# EAGLE design gumbi (EAGLE 5.11)
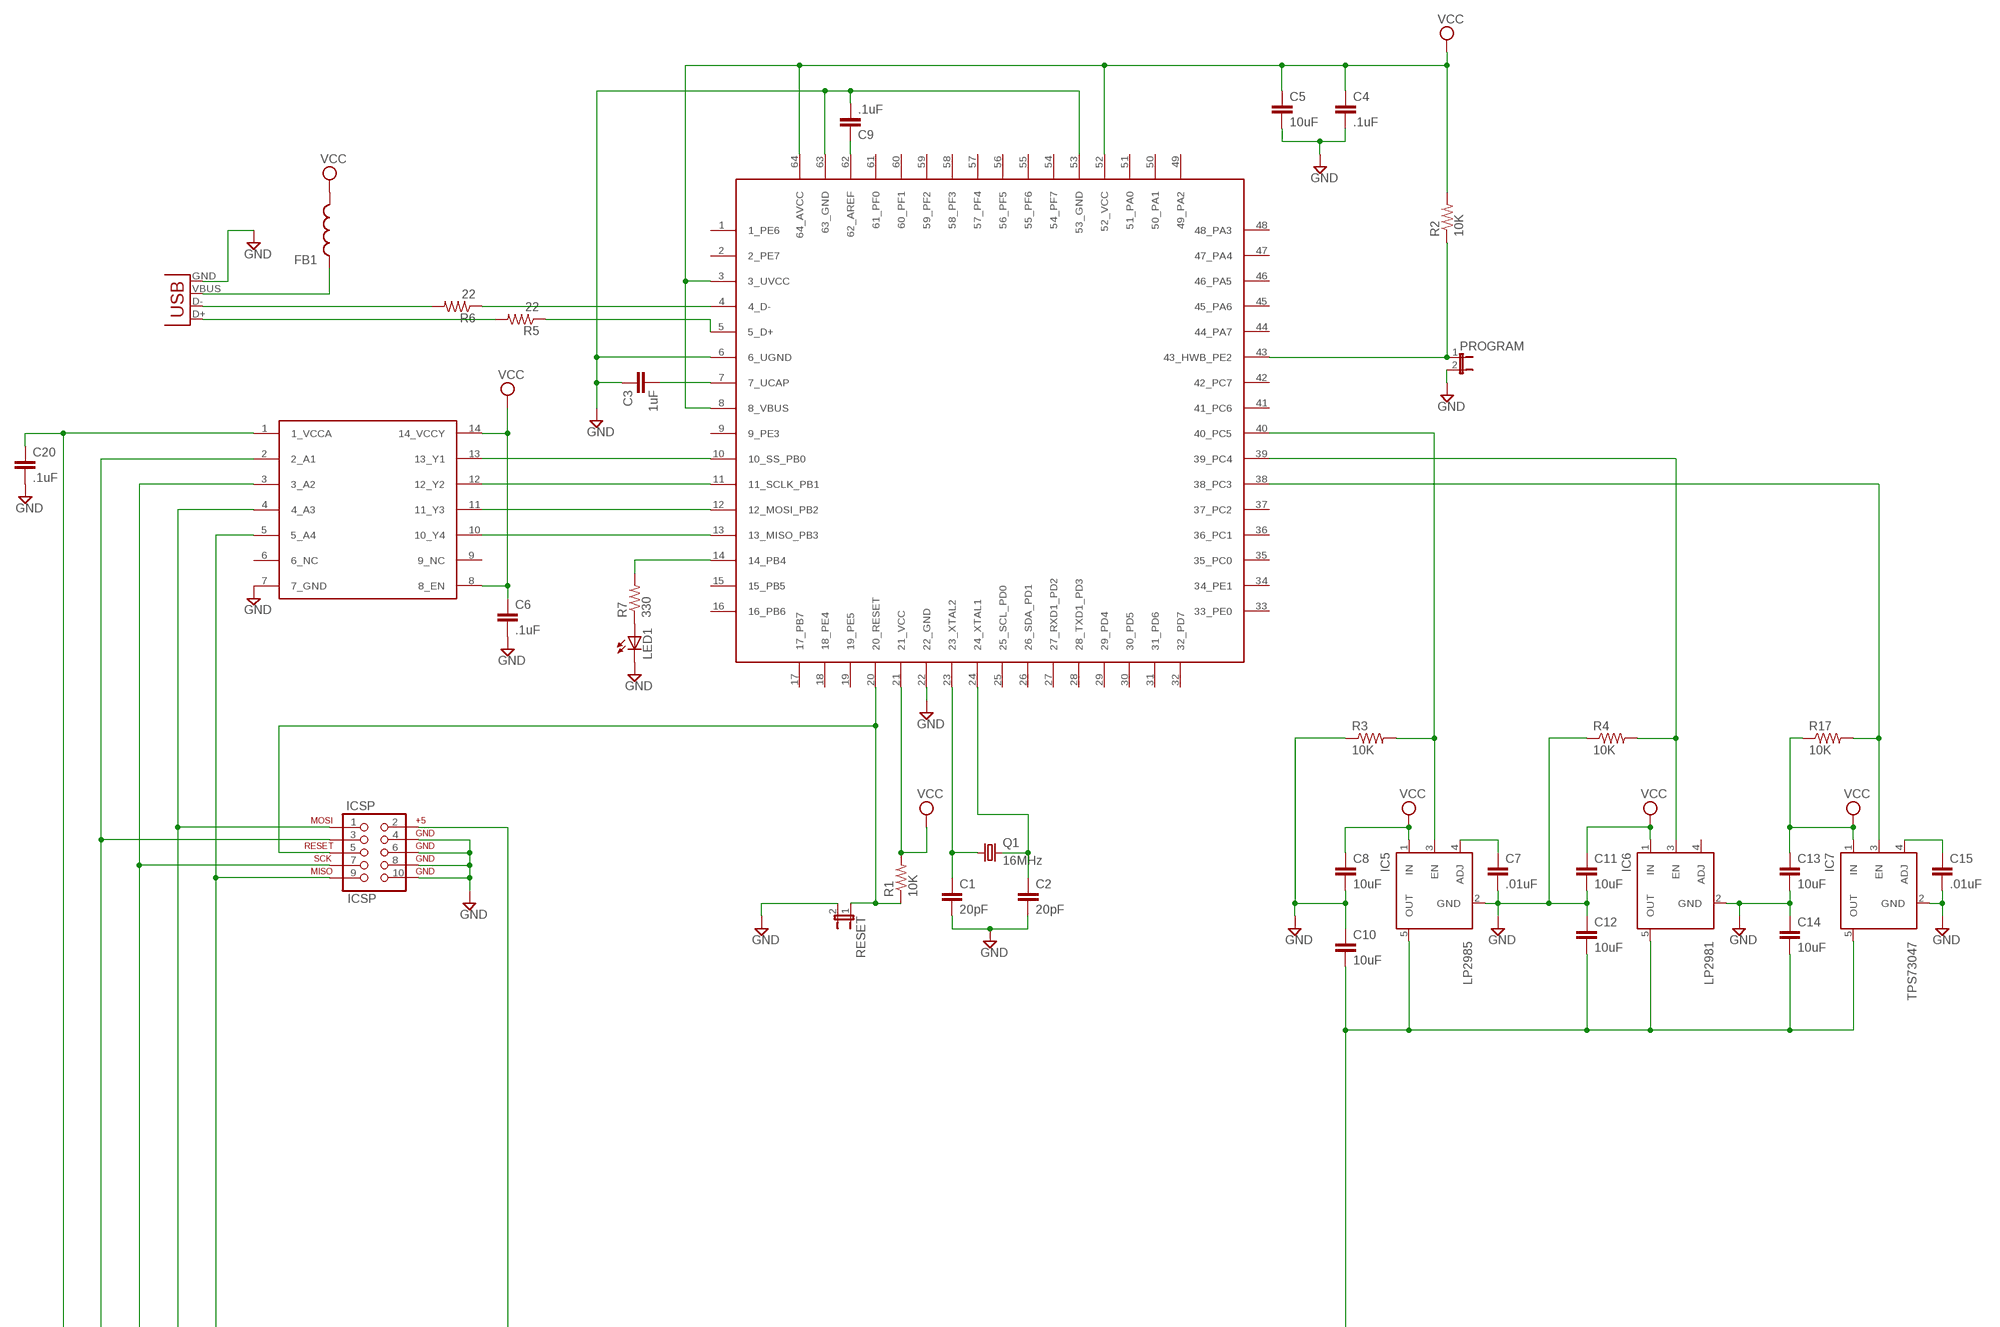
[diagram p0: schematic, sheet 1, part 1 of 2]
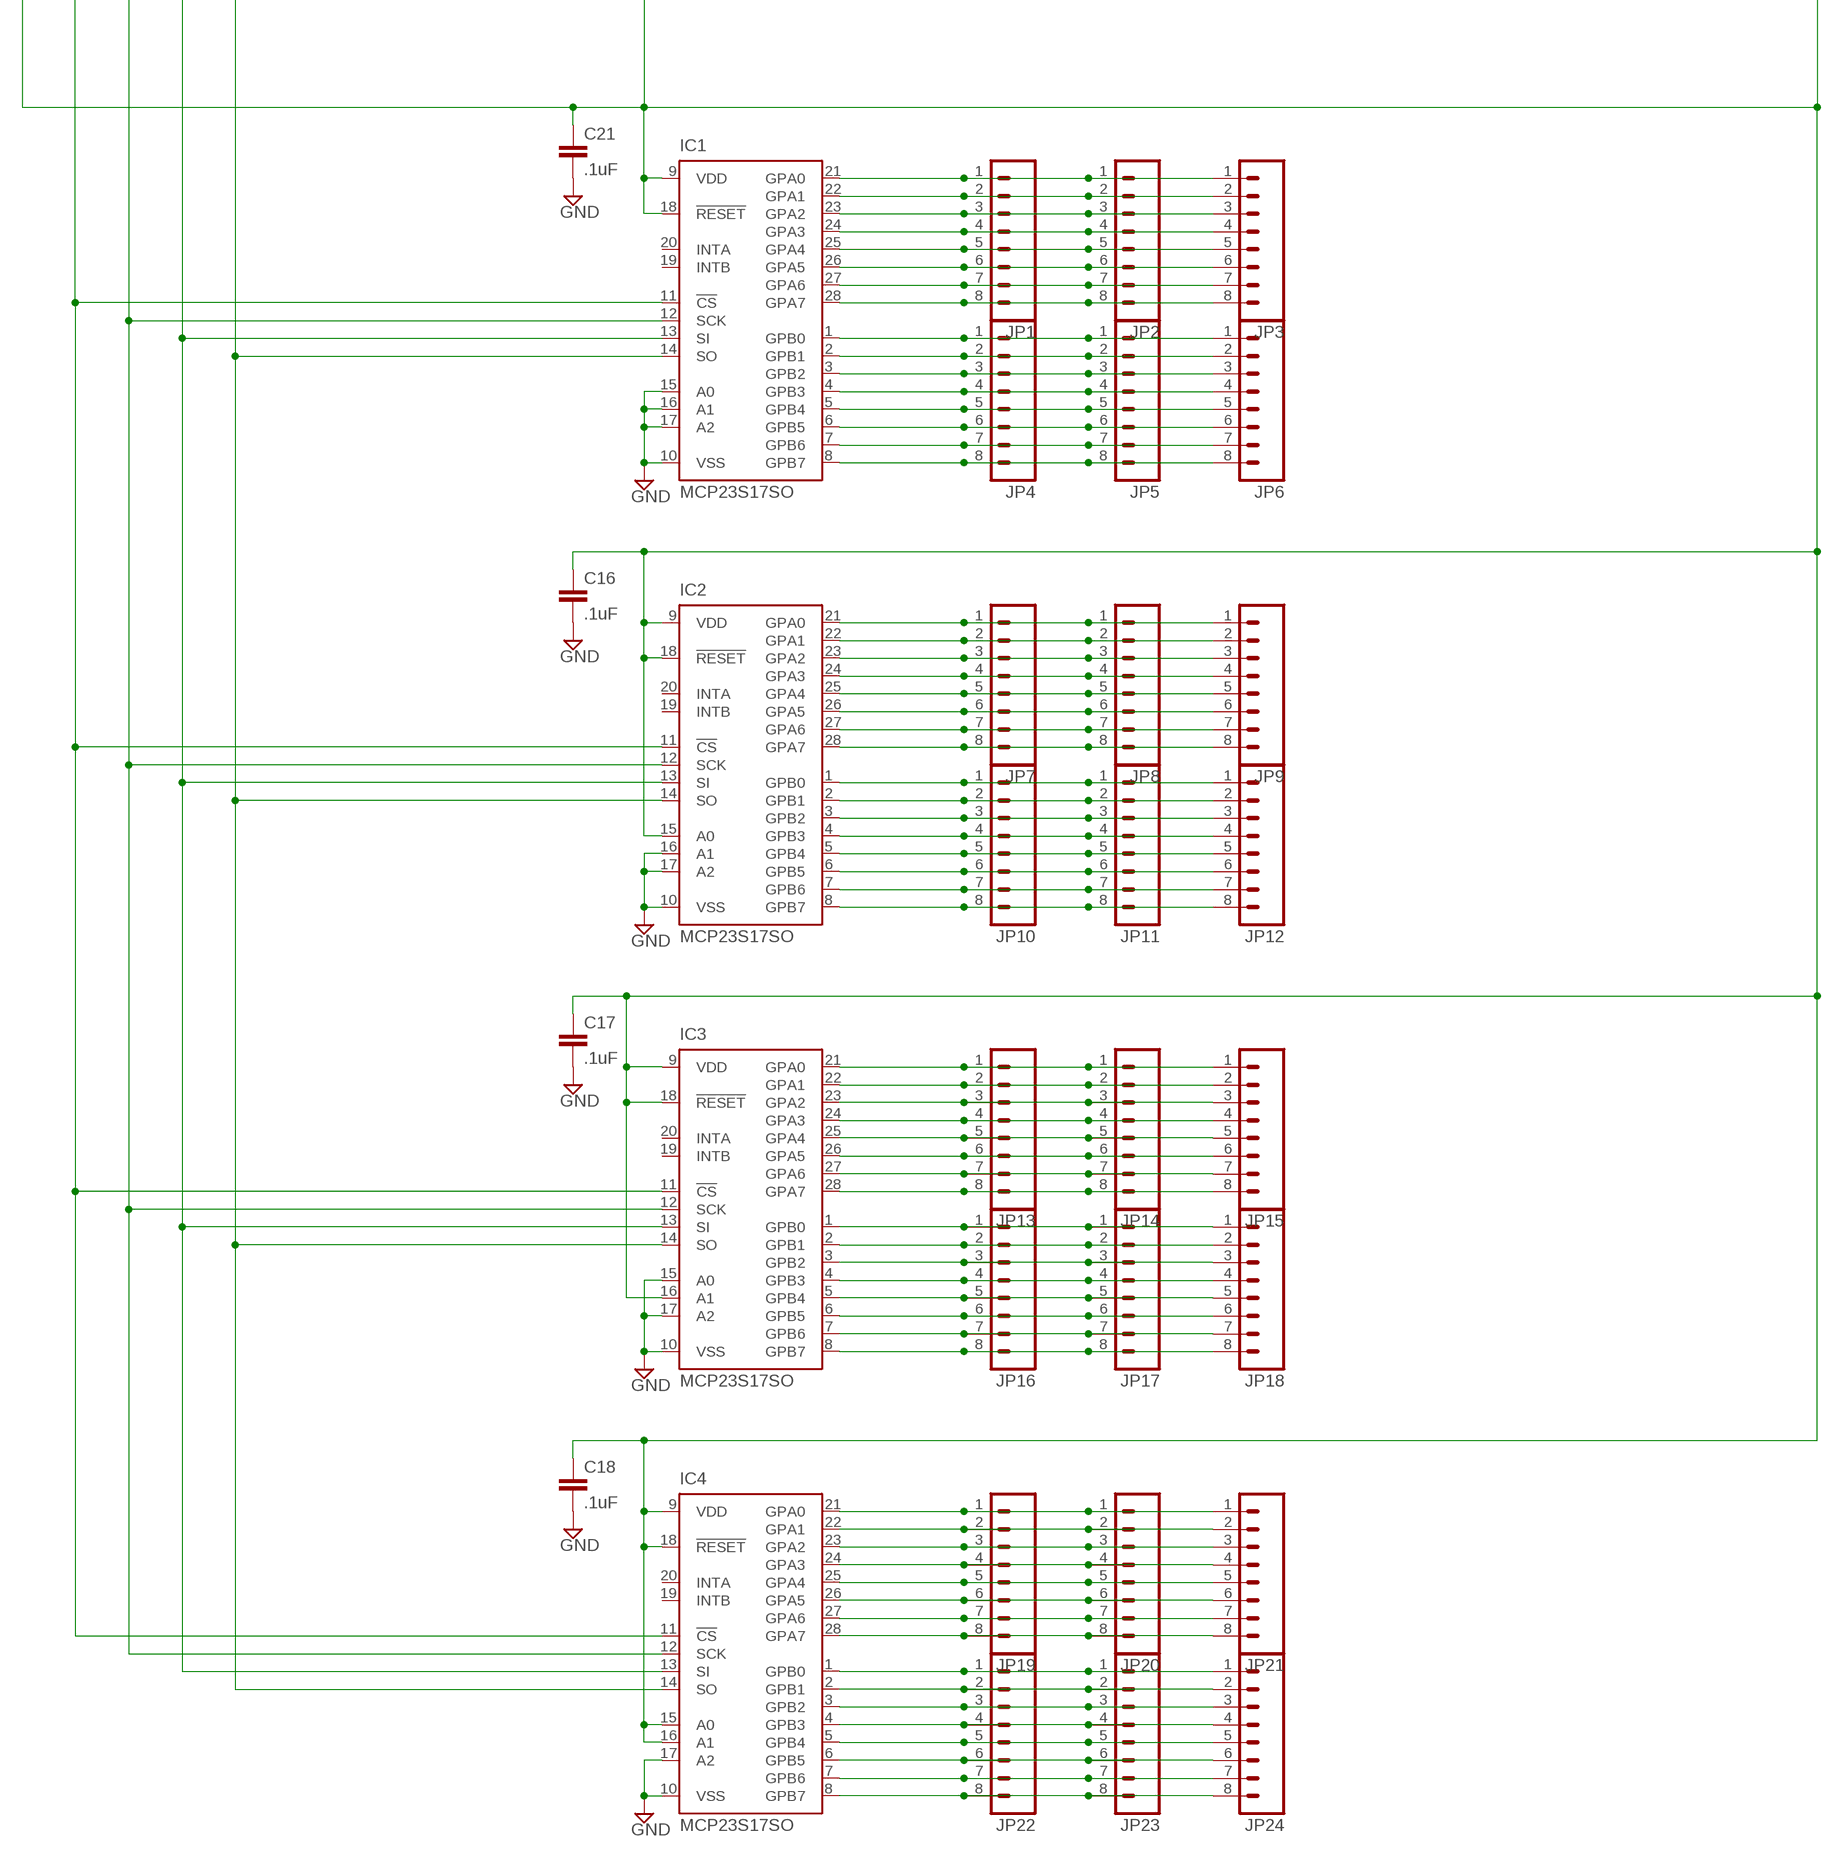
[diagram p1: schematic, sheet 1, part 2 of 2]

## Parts
C1  20pF  CAP0805  [0805]
C2  20pF  CAP0805  [0805]
C3  1uF  CAP0805  [0805]
C4  .1uF  CAP0805  [0805]
C5  10uF  CAP0805  [0805]
C6  .1uF  CAP0805  [0805]
C7  .01uF  CAP0805  [0805]
C8  10uF  CAP0805  [0805]
C9  .1uF  CAP0805  [0805]
C10  10uF  CAP0805  [0805]
C11  10uF  CAP0805  [0805]
C12  10uF  CAP0805  [0805]
C13  10uF  CAP0805  [0805]
C14  10uF  CAP0805  [0805]
C15  .01uF  CAP0805  [0805]
C16  .1uF  CAP0805  [0805]
C17  .1uF  CAP0805  [0805]
C18  .1uF  CAP0805  [0805]
C20  .1uF  CAP0805  [0805]
C21  .1uF  CAP0805  [0805]
FB1  INDUCTOR0805  [0805]
IC1  MCP23S17SO  [SO28W]
IC2  MCP23S17SO  [SO28W]
IC3  MCP23S17SO  [SO28W]
IC4  MCP23S17SO  [SO28W]
IC5  LP2985  MIC5219BM5  [SOT23-5]
IC6  LP2981  MIC5219BM5  [SOT23-5]
IC7  TPS73047  MIC5219BM5  [SOT23-5]
ICSP  ICSP  AVR_SPI_PROG  [AVR_ICSP]
JP1  M081X08  [1X08]
JP2  M081X08  [1X08]
JP3  M081X08  [1X08]
JP4  M081X08  [1X08]
JP5  M081X08  [1X08]
JP6  M081X08  [1X08]
JP7  M081X08  [1X08]
JP8  M081X08  [1X08]
JP9  M081X08  [1X08]
JP10  M081X08  [1X08]
JP11  M081X08  [1X08]
JP12  M081X08  [1X08]
JP13  M081X08  [1X08]
JP14  M081X08  [1X08]
JP15  M081X08  [1X08]
JP16  M081X08  [1X08]
JP17  M081X08  [1X08]
JP18  M081X08  [1X08]
JP19  M081X08  [1X08]
JP20  M081X08  [1X08]
JP21  M081X08  [1X08]
JP22  M081X08  [1X08]
JP23  M081X08  [1X08]
JP24  M081X08  [1X08]
LED1  LED0603  [LED-0603]
PROGRAM  JUMPER-2PTH  [1X02]
Q1  16MHz  CRYSTALSM49  [SM49]
R1  10K  RESISTOR0805-RES  [0805]
R2  10K  RESISTOR0805-RES  [0805]
R3  10K  RESISTOR0805-RES  [0805]
R4  10K  RESISTOR0805-RES  [0805]
R5  22  RESISTOR0805-RES  [0805]
R6  22  RESISTOR0805-RES  [0805]
R7  330  RESISTOR0805-RES  [0805]
R17  10K  RESISTOR0805-RES  [0805]
RESET  JUMPER-2PTH  [1X02]
U1  AT90USB1287  [TQFP64]
U2  ADG3304  [TSSOP14]
X1  USBSMD  [USB-MINIB]

## Nets
GND: C1.2 C2.2 C3.1 C4.2 C5.2 C6.2 C7.2 C8.2 C9.2 C10.1 C11.2 C12.1 C13.2 C14.1 C15.2 C16.2 C17.2 C18.2 C20.2 C21.2 IC1.10(VSS) IC1.15(A0) IC1.16(A1) IC1.17(A2) IC2.10(VSS) IC2.16(A1) IC2.17(A2) IC3.10(VSS) IC3.15(A0) IC3.17(A2) IC4.10(VSS) IC4.17(A2) IC5.2(GND) IC6.2(GND) IC7.2(GND) ICSP.4 ICSP.6 ICSP.8 ICSP.10 LED1.C PROGRAM.2 R3.1 R4.1 RESET.2 U1.6(6_UGND) U1.22(22_GND) U1.53(53_GND) U1.63(63_GND) U2.7(7_GND) X1.GND
N$1: U1.10(10_SS_PB0) U2.13(13_Y1)
N$2: U1.11(11_SCLK_PB1) U2.12(12_Y2)
N$3: U1.12(12_MOSI_PB2) U2.11(11_Y3)
N$4: C9.1 U1.62(62_AREF)
N$5: LED1.A R7.1
N$6: C2.1 Q1.2 U1.24(24_XTAL1)
N$7: R6.2 X1.D-
N$8: ICSP.5 R1.1 RESET.1 U1.20(20_RESET)
N$9: C10.2 C12.2 C14.2 C16.1 C17.1 C18.1 C20.1 C21.1 IC1.9(VDD) IC1.18(!RESET) IC2.9(VDD) IC2.15(A0) IC2.18(!RESET) IC3.9(VDD) IC3.16(A1) IC3.18(!RESET) IC4.9(VDD) IC4.15(A0) IC4.16(A1) IC4.18(!RESET) IC5.5(OUT) IC6.5(OUT) IC7.5(OUT) ICSP.2 U2.1(1_VCCA)
N$10: C3.2 U1.7(7_UCAP)
N$11: R5.1 U1.5(5_D+)
N$12: C1.1 Q1.1 U1.23(23_XTAL2)
N$13: IC1.21(GPA0) JP1.1 JP2.1 JP3.1
N$14: PROGRAM.1 R2.1 U1.43(43_HWB_PE2)
N$15: U1.13(13_MISO_PB3) U2.10(10_Y4)
N$16: R6.1 U1.4(4_D-)
N$17: R5.2 X1.D+
N$18: FB1.1 X1.VBUS
N$19: IC1.22(GPA1) JP1.2 JP2.2 JP3.2
N$20: IC1.23(GPA2) JP1.3 JP2.3 JP3.3
N$21: R7.2 U1.14(14_PB4)
N$22: IC1.24(GPA3) JP1.4 JP2.4 JP3.4
N$23: IC1.25(GPA4) JP1.5 JP2.5 JP3.5
N$24: IC1.26(GPA5) JP1.6 JP2.6 JP3.6
N$25: IC1.27(GPA6) JP1.7 JP2.7 JP3.7
N$26: IC1.28(GPA7) JP1.8 JP2.8 JP3.8
N$27: IC1.1(GPB0) JP4.1 JP5.1 JP6.1
N$28: IC1.2(GPB1) JP4.2 JP5.2 JP6.2
N$29: IC1.3(GPB2) JP4.3 JP5.3 JP6.3
N$30: IC1.4(GPB3) JP4.4 JP5.4 JP6.4
N$31: IC1.5(GPB4) JP4.5 JP5.5 JP6.5
N$32: IC1.6(GPB5) JP4.6 JP5.6 JP6.6
N$33: IC1.7(GPB6) JP4.7 JP5.7 JP6.7
N$34: IC1.8(GPB7) JP4.8 JP5.8 JP6.8
N$35: IC2.21(GPA0) JP7.1 JP8.1 JP9.1
N$36: IC2.22(GPA1) JP7.2 JP8.2 JP9.2
N$37: IC2.23(GPA2) JP7.3 JP8.3 JP9.3
N$38: IC2.24(GPA3) JP7.4 JP8.4 JP9.4
N$39: IC2.25(GPA4) JP7.5 JP8.5 JP9.5
N$40: IC2.26(GPA5) JP7.6 JP8.6 JP9.6
N$41: IC2.27(GPA6) JP7.7 JP8.7 JP9.7
N$42: IC2.28(GPA7) JP7.8 JP8.8 JP9.8
N$43: IC2.1(GPB0) JP10.1 JP11.1 JP12.1
N$44: IC2.2(GPB1) JP10.2 JP11.2 JP12.2
N$45: IC2.3(GPB2) JP10.3 JP11.3 JP12.3
N$46: IC2.4(GPB3) JP10.4 JP11.4 JP12.4
N$47: IC2.5(GPB4) JP10.5 JP11.5 JP12.5
N$48: IC2.6(GPB5) JP10.6 JP11.6 JP12.6
N$49: IC2.7(GPB6) JP10.7 JP11.7 JP12.7
N$50: IC2.8(GPB7) JP10.8 JP11.8 JP12.8
N$51: IC3.21(GPA0) JP13.1 JP14.1 JP15.1
N$52: IC3.22(GPA1) JP13.2 JP14.2 JP15.2
N$53: IC3.23(GPA2) JP13.3 JP14.3 JP15.3
N$54: IC3.24(GPA3) JP13.4 JP14.4 JP15.4
N$55: IC3.25(GPA4) JP13.5 JP14.5 JP15.5
N$56: IC3.26(GPA5) JP13.6 JP14.6 JP15.6
N$57: IC3.27(GPA6) JP13.7 JP14.7 JP15.7
N$58: IC3.28(GPA7) JP13.8 JP14.8 JP15.8
N$59: IC3.1(GPB0) JP16.1 JP17.1 JP18.1
N$60: IC3.2(GPB1) JP16.2 JP17.2 JP18.2
N$61: IC3.3(GPB2) JP16.3 JP17.3 JP18.3
N$62: IC3.4(GPB3) JP16.4 JP17.4 JP18.4
N$63: IC3.5(GPB4) JP16.5 JP17.5 JP18.5
N$64: IC3.6(GPB5) JP16.6 JP17.6 JP18.6
N$65: IC3.7(GPB6) JP16.7 JP17.7 JP18.7
N$66: IC3.8(GPB7) JP16.8 JP17.8 JP18.8
N$67: IC4.21(GPA0) JP19.1 JP20.1 JP21.1
N$68: IC4.22(GPA1) JP19.2 JP20.2 JP21.2
N$69: IC4.23(GPA2) JP19.3 JP20.3 JP21.3
N$70: IC4.24(GPA3) JP19.4 JP20.4 JP21.4
N$71: IC4.25(GPA4) JP19.5 JP20.5 JP21.5
N$72: IC4.26(GPA5) JP19.6 JP20.6 JP21.6
N$73: IC4.27(GPA6) JP19.7 JP20.7 JP21.7
N$74: IC4.28(GPA7) JP19.8 JP20.8 JP21.8
N$75: IC4.1(GPB0) JP22.1 JP23.1 JP24.1
N$76: IC4.2(GPB1) JP22.2 JP23.2 JP24.2
N$77: IC4.3(GPB2) JP22.3 JP23.3 JP24.3
N$78: IC4.4(GPB3) JP22.4 JP23.4 JP24.4
N$79: IC4.5(GPB4) JP22.5 JP23.5 JP24.5
N$80: IC4.6(GPB5) JP22.6 JP23.6 JP24.6
N$81: IC4.7(GPB6) JP22.7 JP23.7 JP24.7
N$82: IC4.8(GPB7) JP22.8 JP23.8 JP24.8
N$84: IC1.12(SCK) IC2.12(SCK) IC3.12(SCK) IC4.12(SCK) ICSP.7 U2.3(3_A2)
N$85: IC1.13(SI) IC2.13(SI) IC3.13(SI) IC4.13(SI) ICSP.1 U2.4(4_A3)
N$86: IC1.14(SO) IC2.14(SO) IC3.14(SO) IC4.14(SO) ICSP.9 U2.5(5_A4)
N$87: C15.1 IC7.4(ADJ)
N$91: IC1.11(!CS) IC2.11(!CS) IC3.11(!CS) IC4.11(!CS) ICSP.3 U2.2(2_A1)
N$127: IC5.3(EN) R3.2 U1.40(40_PC5)
N$128: IC6.3(EN) R4.2 U1.39(39_PC4)
N$129: IC7.3(EN) R17.2 U1.38(38_PC3)
N$130: C7.1 IC5.4(ADJ)
VCC: C4.1 C5.1 C6.1 C8.1 C11.1 C13.1 FB1.2 IC5.1(IN) IC6.1(IN) IC7.1(IN) R1.2 R2.2 R17.1 U1.3(3_UVCC) U1.8(8_VBUS) U1.21(21_VCC) U1.52(52_VCC) U1.64(64_AVCC) U2.8(8_EN) U2.14(14_VCCY)
Unconnected: IC1.19(INTB) IC1.20(INTA) IC2.19(INTB) IC2.20(INTA) IC3.19(INTB) IC3.20(INTA) IC4.19(INTB) IC4.20(INTA) IC6.4(ADJ) U1.1(1_PE6) U1.2(2_PE7) U1.9(9_PE3) U1.15(15_PB5) U1.16(16_PB6) U1.17(17_PB7) U1.18(18_PE4) U1.19(19_PE5) U1.25(25_SCL_PD0) U1.26(26_SDA_PD1) U1.27(27_RXD1_PD2) U1.28(28_TXD1_PD3) U1.29(29_PD4) U1.30(30_PD5) U1.31(31_PD6) U1.32(32_PD7) U1.33(33_PE0) U1.34(34_PE1) U1.35(35_PC0) U1.36(36_PC1) U1.37(37_PC2) U1.41(41_PC6) U1.42(42_PC7) U1.44(44_PA7) U1.45(45_PA6) U1.46(46_PA5) U1.47(47_PA4) U1.48(48_PA3) U1.49(49_PA2) U1.50(50_PA1) U1.51(51_PA0) U1.54(54_PF7) U1.55(55_PF6) U1.56(56_PF5) U1.57(57_PF4) U1.58(58_PF3) U1.59(59_PF2) U1.60(60_PF1) U1.61(61_PF0) U2.6(6_NC) U2.9(9_NC)

## Library data of the parts
C1-C18 C20 C21 = SparkFun:CAP: Capacitor Standard 0603 ceramic capacitor, and 0.1" leaded capacitor.
FB1 = SparkFun:INDUCTOR: Inductors Basic Inductor/Choke - 0603 and 1206. Footprints are not proven and vary greatly between part numbers.
IC1-IC4 = microchip:MCP23S17: http://ww1.microchip.com/downloads/en/DeviceDoc/21952a.pdf Source: http://ww1.microchip.com/downloads/en/DeviceDoc/21952a.pdf; MF: MICROCHIP; MPN: MCP23S17-E/SO; OC_FARNELL: unknown; OC_NEWARK: 31K2950
IC5-IC7 = v-reg-micrel:MIC5219BM5: VOLTAGE REGULATOR; MF: ALTERA CORPORATION; MPN: MIC5219BM5 TR; OC_FARNELL: 1100656; OC_NEWARK: 09J8939
ICSP = SparkFun:AVR_SPI_PROG: AVR ICSP Header This is the standard AVR In Circuit Serial Programming header. Minimal, but includes pin one indicator. Works with standard Olimex programmers. Also look for the 6-pin reduced version. Spark Fun Electronics SKU: PRT-00778
JP1-JP24 = SparkFun:M08: Header 8 Standard 8-pin 0.1" header. Use with straight break away headers (SKU : PRT-00116), right angle break away headers (PRT-00553), swiss pins (PRT-00743), machine pins (PRT-00117), and female headers (PRT-00115).
LED1 = SparkFun:LED: LEDs Standard schematic elements and footprints for 5mm, 3mm, 1206, and 0603 sized LEDs. 5mm - Spark Fun Electronics SKU : COM-00529 (and others)
PROGRAM RESET = SparkFun:JUMPER-2: Jumper Basic 0.1" spaced jumper. Use with breakaway headers.
Q1 = crystal:CRYSTAL: CRYSTAL; OC_FARNELL: unknown; OC_NEWARK: unknown
R1-R7 R17 = SparkFun:RESISTOR: Resistor Basic schematic elements and footprints for 0603, 1206, and PTH resistors.
U1 = atmel:AT90USB1287: Atmel AVR AT90USB1287.
U2 = analog-devices:ADG3304: ADG3304 LV Logic Level Translator
X1 = SparkFun:USB: USB Connectors USB-B-PTH is fully proven SKU : PRT-00139 USB-miniB is fully proven SKU : PRT-00587 USB-A-PCB is untested. USB-A-H is throughly reviewed, but untested. Spark Fun Electronics SKU : PRT-00437 USB-B-SMT is throughly reviewed, but untested. Needs silkscreen touching up. USB-A-S has not been used/tested USB-MB-H has not been used/tested

## Board
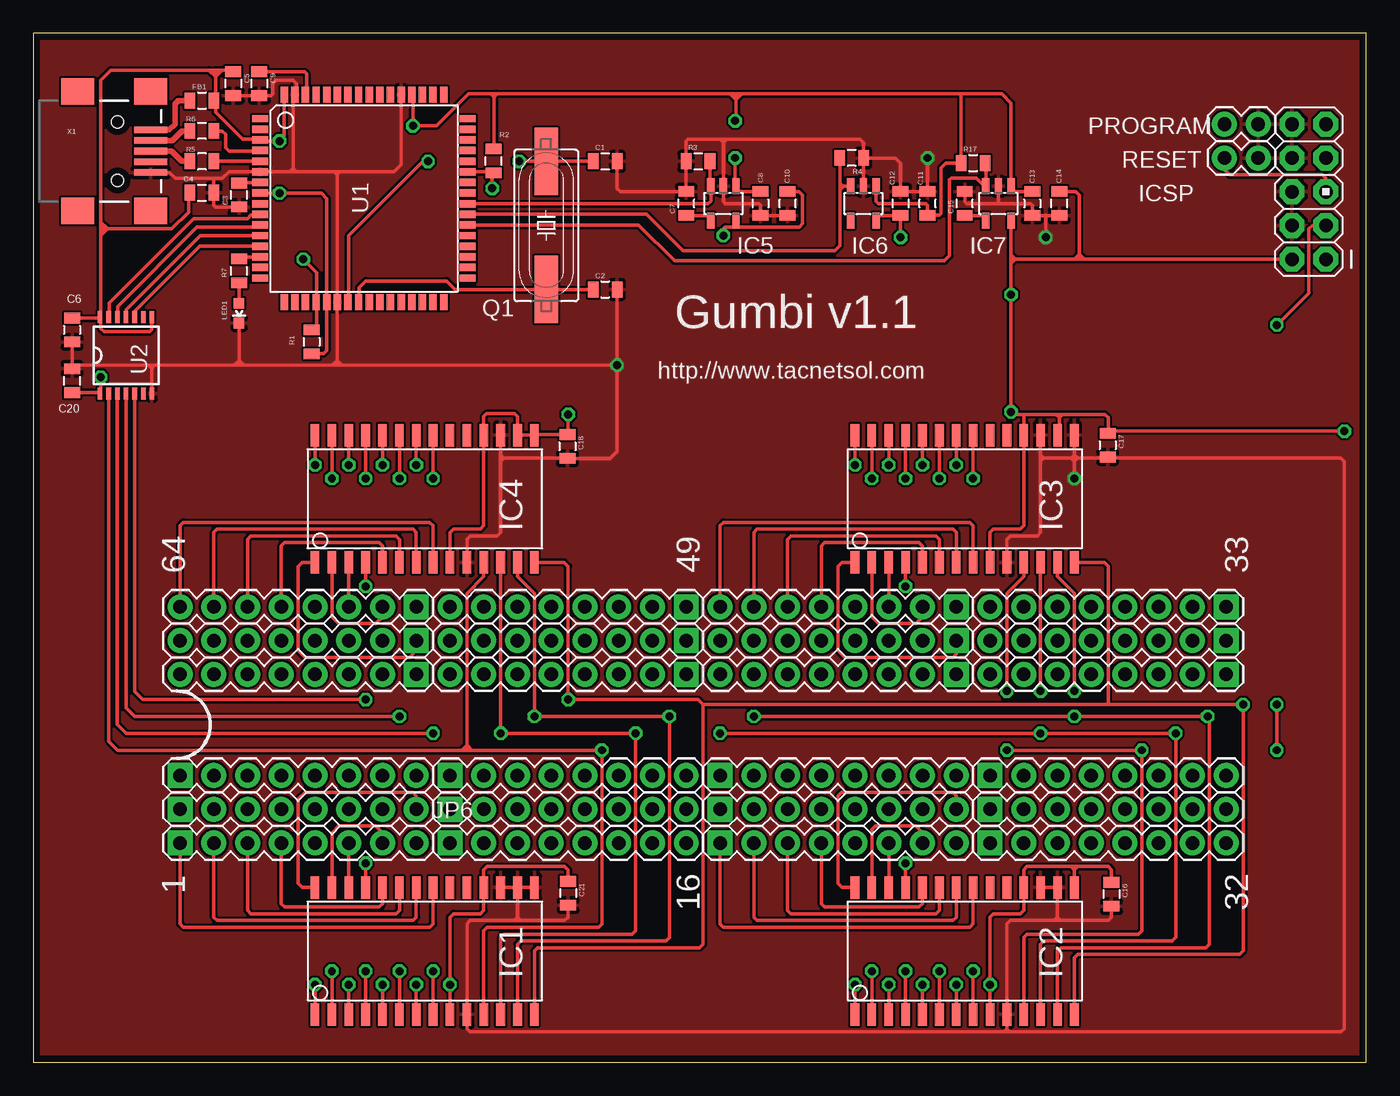
[diagram p2: board, top side]
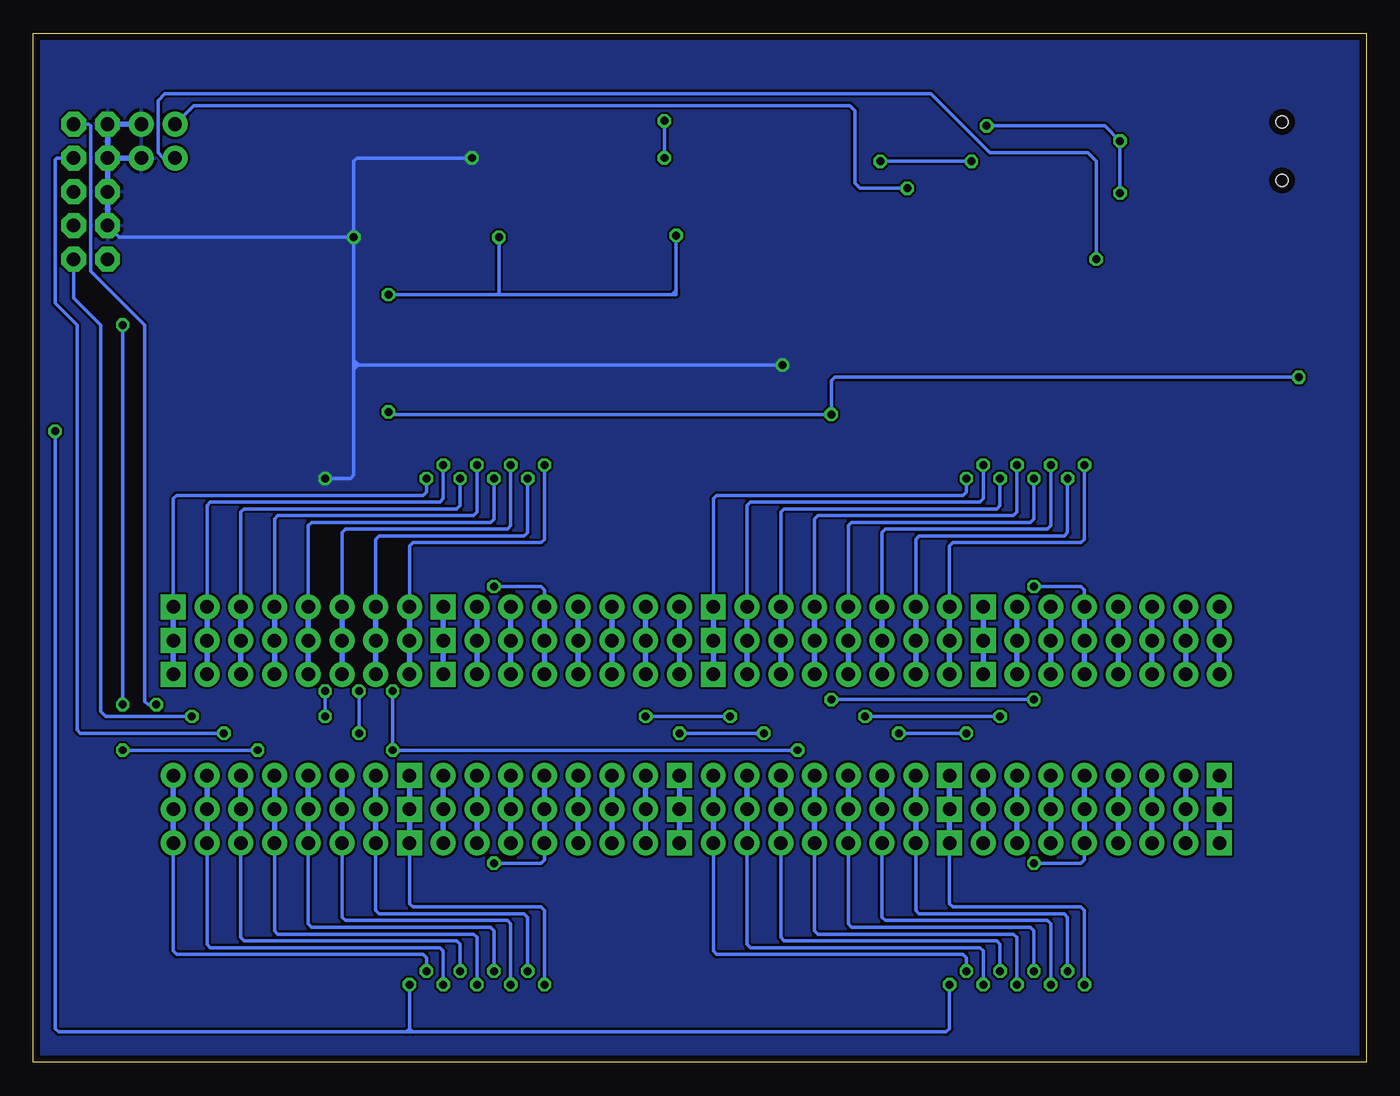
[diagram p3: board, bottom side, seen from below]

Size 100.33 x 77.46 mm. Coordinates in mm from the lower left corner, seen from the top.
Outline: 0,0 100.33,0 100.33,77.46 0,77.46 0,0
Copper layers (1*16): Top 0.0356mm / dielectric 1.5011mm / Bottom 0.0356mm
Design rules "SilverCircuits": minimum track width 7mil, minimum drill 14mil, track to track 7mil, track to pad 7mil, pad to pad 7mil, via to via 7mil, smd to smd 0mil, copper to edge 20mil, drill to drill 8mil, minimum pad ring 10mil, minimum via ring 8mil, stop-mask expansion 4mil, vias tented up to drill 0mil, thermal gap 10mil

### Footprints (pad centres in the part's own frame; a part is rotated, then mirrored left to right if it is on the bottom)
0805 = smd 0.8 x 1.2: 1 -0.9,0; 2 0.9,0
SO28W = smd 0.65 x 1.7: 1 -7.62,-4.78; 2 -6.35,-4.78; 3 -5.08,-4.78; 4 -3.81,-4.78; 5 -2.54,-4.78; 6 -1.27,-4.78; 7 0,-4.78; 8 1.27,-4.78; 9 2.54,-4.78; 10 3.81,-4.78; 11 5.08,-4.78; 12 6.35,-4.78; 13 7.62,-4.78; 14 8.89,-4.78; 15 8.89,4.78; 16 7.62,4.78; 17 6.35,4.78; 18 5.08,4.78; 19 3.81,4.78; 20 2.54,4.78; 21 1.27,4.78; 22 0,4.78; 23 -1.27,4.78; 24 -2.54,4.78; 25 -3.81,4.78; 26 -5.08,4.78; 27 -6.35,4.78; 28 -7.62,4.78
SOT23-5 = smd 0.55 x 1.2: 1 -0.95,-1.3; 2 0,-1.3; 3 0.95,-1.3; 4 0.95,1.3; 5 -0.95,1.3
AVR_ICSP = drill 1.016 pad 1.88 octagon: 1 -1.27,5.08; 2 1.27,5.08; 3 -1.27,2.54; 4 1.27,2.54; 5 -1.27,0; 6 1.27,0; 7 -1.27,-2.54; 8 1.27,-2.54; 9 -1.27,-5.08; 10 1.27,-5.08
1X08 = drill 1.016 pad 1.88 square: 1 0,0 | drill 1.016 pad 1.88 round: 2 2.54,0; 3 5.08,0; 4 7.62,0; 5 10.16,0; 6 12.7,0; 7 15.24,0; 8 17.78,0
LED-0603 = smd 0.8 x 0.8: A 0,-0.75; C 0,0.75
1X02 = drill 1.016 pad 1.88 round: 1 0,0; 2 2.54,0
SM49 = smd 5.08 x 1.778: 1 -4.826,0; 2 4.826,0
TQFP64 = smd 1.194 x 0.559: 1 -7.8,6; 2 -7.8,5.2; 3 -7.8,4.4; 4 -7.8,3.6; 5 -7.8,2.8; 6 -7.8,2; 7 -7.8,1.2; 8 -7.8,0.4; 9 -7.8,-0.4; 10 -7.8,-1.2; 11 -7.8,-2; 12 -7.8,-2.8; 13 -7.8,-3.6; 14 -7.8,-4.4; 15 -7.8,-5.2; 16 -7.8,-6; 33 7.8,-6; 34 7.8,-5.2; 35 7.8,-4.4; 36 7.8,-3.6; 37 7.8,-2.8; 38 7.8,-2; 39 7.8,-1.2; 40 7.8,-0.4; 41 7.8,0.4; 42 7.8,1.2; 43 7.8,2; 44 7.8,2.8; 45 7.8,3.6; 46 7.8,4.4; 47 7.8,5.2; 48 7.8,6 | smd 0.559 x 1.194: 17 -6,-7.8; 18 -5.2,-7.8; 19 -4.4,-7.8; 20 -3.6,-7.8; 21 -2.8,-7.8; 22 -2,-7.8; 23 -1.2,-7.8; 24 -0.4,-7.8; 25 0.4,-7.8; 26 1.2,-7.8; 27 2,-7.8; 28 2.8,-7.8; 29 3.6,-7.8; 30 4.4,-7.8; 31 5.2,-7.8; 32 6,-7.8; 49 6,7.8; 50 5.2,7.8; 51 4.4,7.8; 52 3.6,7.8; 53 2.8,7.8; 54 2,7.8; 55 1.2,7.8; 56 0.4,7.8; 57 -0.4,7.8; 58 -1.2,7.8; 59 -2,7.8; 60 -2.8,7.8; 61 -3.6,7.8; 62 -4.4,7.8; 63 -5.2,7.8; 64 -6,7.8
TSSOP14 = smd 0.9 x 0.35: 1 -2.875,1.95; 2 -2.875,1.3; 3 -2.875,0.65; 4 -2.875,0; 5 -2.875,-0.65; 6 -2.875,-1.3; 7 -2.875,-1.95; 8 2.875,-1.95; 9 2.875,-1.3; 10 2.875,-0.65; 11 2.875,0; 12 2.875,0.65; 13 2.875,1.3; 14 2.875,1.95
USB-MINIB = smd 2.5 x 0.5: D+ 2.5,0; D- 2.5,0.8; GND 2.5,-1.6; ID 2.5,-0.8; VBUS 2.5,1.6 | smd 2.5 x 2: MTN1 -3,4.5; MTN2 2.5,4.5; MTN3 -3,-4.5; MTN4 2.5,-4.5 | hole 0.9: 0,2.2; 0,-2.2

### Placement (x,y rotation side)
C1  43.05,67.82 0 top
C2  43.05,58.17 0 top
C3  15.49,65.28 90 top
C4  12.7,65.46 0 top
C5  15.06,73.66 270 top
C6  2.92,55.12 270 top
C7  49.15,64.64 90 top
C8  54.74,64.64 270 top
C9  17.02,73.66 270 top
C10  56.77,64.64 90 top
C11  67.31,64.64 90 top
C12  65.28,64.64 270 top
C13  75.18,64.64 270 top
C14  77.22,64.64 90 top
C15  70.1,64.64 90 top
C16  81.15,12.65 270 top
C17  80.87,46.46 270 top
C18  40.21,46.35 270 top
C20  2.92,51.31 90 top
C21  40.26,12.73 270 top
FB1  12.7,72.39 0 top
IC1  28.83,8.38 0 top
IC2  69.47,8.38 0 top
IC3  69.47,42.42 0 top
IC4  28.83,42.42 0 top
IC5  51.94,64.64 180 top
IC6  62.48,64.64 180 top
IC7  72.64,64.64 180 top
ICSP  96.01,65.53 180 top
JP1  11.05,21.59 0 top
JP2  11.05,19.05 0 top
JP3  11.05,16.51 0 top
JP4  31.37,21.59 0 top
JP5  31.37,19.05 0 top
JP6  31.37,16.51 0 top
JP7  51.69,21.59 0 top
JP8  51.69,19.05 0 top
JP9  51.69,16.51 0 top
JP10  72.01,16.51 0 top
JP11  72.01,21.59 0 top
JP12  72.01,19.05 0 top
JP13  89.79,29.21 180 top
JP14  89.79,31.75 180 top
JP15  89.79,34.29 180 top
JP16  69.47,29.21 180 top
JP17  69.47,34.29 180 top
JP18  69.47,31.75 180 top
JP19  49.15,29.21 180 top
JP20  49.15,34.29 180 top
JP21  49.15,31.75 180 top
JP22  28.83,34.29 180 top
JP23  28.83,31.75 180 top
JP24  28.83,29.21 180 top
LED1  15.49,56.39 180 top
PROGRAM  89.66,70.61 0 top
Q1  38.61,62.99 270 top
R1  20.95,54.23 270 top
R2  34.65,67.84 90 top
R3  50.04,67.82 0 top
R4  61.59,68.07 180 top
R5  12.7,67.82 180 top
R6  12.7,70.1 180 top
R7  15.49,59.56 90 top
R17  70.74,67.69 0 top
RESET  89.66,68.07 0 top
U1  24.89,65.02 0 top
U2  6.99,53.21 90 top
X1  6.35,68.58 0 top

### Tracks (layer width: path | path; a pad name or v marks a point on that pad's centre or on a via)
GND  (via drill 0.6)
  Top 0.254: X1.GND 10.24,66.98 10.67,66.55 13.46,66.55 | 22.86,66.8 22.61,67.06 | U1.53 27.69,72.4 27.69,72.39 27.69,67.56 27.18,67.06 23.11,67.06 | 22.61,67.06 23.11,67.06 | IC1.16 IC1.17 | IC1.16 IC1.15 36.49,13.16 36.45,13.21 | IC2.17 IC2.16 77.09,10.92 | 76.83,10.67 73.53,10.67 73.28,10.41 IC2.10 73.28,2.54 | 76.83,10.67 77.09,10.92 | 36.2,10.67 32.89,10.67 32.64,10.41 IC1.10 32.64,2.54 32.89,2.29 73.03,2.29 | 36.2,10.67 36.45,10.92 | IC1.17 36.4,13.16 36.45,13.21 | IC1.16 36.45,13.21 | 36.45,10.92 36.7,10.67 | 36.45,10.67 36.7,10.67 | 36.45,10.92 36.45,10.67 | 36.45,12.95 IC1.16 | 36.7,10.67 40.01,10.67 40.26,10.92 C21.2 | 77.09,10.92 77.34,10.67 | 76.83,10.67 77.34,10.67 | 77.34,10.67 80.9,10.67 81.15,10.92 C16.2 | 35.43,45.47 35.18,45.72 | 35.18,45.72 IC4.17 | IC4.10 32.64,39.37 32.89,39.62 34.92,39.62 35.18,39.88 35.18,45.21 | 35.43,45.47 35.18,45.21 | 35.18,45.72 35.18,45.21 | 78.36,45.72 IC3.15 | 78.36,45.72 78.11,45.47 | 78.11,45.47 76.07,45.47 | 76.07,45.47 75.82,45.72 IC3.17 75.82,45.47 | 75.82,45.21 75.82,45.47 | 78.61,45.47 78.36,45.72 | 78.61,45.47 78.36,45.47 | 78.36,45.47 78.11,45.47 | IC1.17 36.24,13.16 36.45,12.95 | 36.45,10.92 36.45,12.95 | 36.2,10.67 36.45,10.67 | 73.03,2.29 73.28,2.54 | 22.86,66.8 23.11,67.06 | 22.86,57.26 22.86,66.8 | 22.86,57.26 U1.22 22.91,57.2 | 19.3,67.06 17.12,67.06 U1.6 17.06,67.06 14.73,67.06 14.22,66.55 13.46,66.55 | 19.81,67.06 19.3,67.06 | 22.61,67.06 19.81,67.06 | 19.3,67.06 19.56,67.31 | 19.81,67.06 19.56,67.31 | 19.56,67.31 19.56,72.69 U1.63 19.81,72.94 19.81,73.66 19.56,73.91 18.29,73.91 18.03,73.66 18.03,72.9 17.9,72.76 C9.2 C5.2 | IC3.10 73.28,39.37 73.53,39.62 75.56,39.62 75.82,39.88 75.82,45.21
  Top 0.254: 76.07,45.47 75.82,45.21 | 73.28,2.54 73.53,2.29 | 73.03,2.29 73.53,2.29 | 73.53,2.29 98.42,2.29 98.68,2.54 98.68,45.21 98.42,45.47 80.96,45.47 C17.2 80.74,45.56 80.64,45.47 78.61,45.47 | U2.7 8.91,50.36 8.91,52.25 | 8.91,52.48 8.91,52.27 | 8.91,52.27 8.91,52.25 | 8.91,52.25 8.71,52.45 8.74,52.45 | 8.91,52.27 8.74,52.45 | 8.91,52.27 8.94,52.27 | 8.94,52.27 9.09,52.43 | 8.91,52.25 8.94,52.27 | 8.74,52.48 8.74,52.45 | 8.91,52.48 8.74,52.48 | 8.74,52.48 2.92,52.48 C20.2 C6.2 | 9.02,52.48 8.91,52.48 | 9.02,52.48 9.02,52.45 | 35.43,45.47 40.2,45.47 C18.2 43.42,45.45 43.94,45.97 v43.94,52.48 | 13.46,66.55 13.59,66.42 C4.2 13.59,65.44 13.59,64.52 13.73,64.38 C3.1 | C10.1 C8.2 54.74,64.52 54.61,64.64 52.07,64.64 51.94,64.77 IC5.2 51.94,69.22 | IC6.2 62.49,65.94 R4.1 | R4.1 64.9,68.07 65.28,67.69 C12.1 C11.2 v67.31,68.07 | 72.77,64.64 75.06,64.64 75.18,64.52 C13.2 C14.1 76.21,63.74 76.2,63.75 v76.2,62.1 | 72.77,64.64 72.64,64.77 | 72.64,64.77 IC7.2 | C15.2 70.1,64.77 70.23,64.64 72.52,64.64 | 72.64,64.77 72.52,64.64 | 72.77,64.64 72.52,64.64 | 51.69,69.47 51.94,69.22 | 51.69,69.47 49.28,69.47 49.15,69.34 R3.1 49.14,65.55 C7.2 49.14,65.53 44.2,65.53 43.95,65.78 C1.2 | R4.1 62.49,69.2 62.23,69.47 52.2,69.47 | 52.2,69.47 51.69,69.47 | 52.2,69.47 51.94,69.22 | 76.07,45.47 75.82,45.47 | 78.36,45.47 78.36,45.21 | 78.36,45.21 v78.36,43.94 | 78.61,45.47 78.36,45.21 | 78.36,45.21 78.11,45.47 | 22.76,52.48 15.49,52.48 | 15.49,52.48 9.02,52.48 | 22.76,52.48 22.86,52.58 22.86,52.83 | 22.86,52.83 22.86,57.26 | 22.86,52.83 22.61,52.58 | 22.86,52.83 23.11,52.58 | v43.94,52.48 22.76,52.48 | 15.49,52.48 15.49,52.83 | 15.49,52.83 LED1.C | 15.49,52.83 15.75,52.58
  Top 0.254: 15.49,52.83 15.24,52.58 | C2.2 43.95,52.49 v43.94,52.48
  Bottom 0.254: ICSP.8 ICSP.4 93.85,62.1 v76.2,62.1 | v67.31,68.07 75.95,68.07 76.2,67.82 v76.2,62.1 | v78.36,43.94 76.45,43.94 76.2,44.2 76.2,52.15 | 76.2,52.15 76.2,52.48 | 76.2,52.48 76.2,52.86 | 76.2,52.86 v76.2,62.1 | 76.2,52.48 v43.94,52.48 | 76.2,52.86 75.84,52.5 76.2,52.15
  Bottom 0.406: ICSP.8 ICSP.10 PROGRAM.2 | ICSP.8 ICSP.6 ICSP.4 | ICSP.8 RESET.2
  pour Top: 0,77.47 100.33,77.47 100.33,0 0,0
  pour Bottom: 0,77.47 100.33,77.47 100.33,0 0,0
N$1
  Top 0.254: U1.10 16.71,63.82 16.64,63.75 16.38,63.75 16.13,63.5 12.06,63.5 5.71,57.15 5.71,56.12 U2.13
N$2
  Top 0.254: U1.11 16.92,63.02 16.76,62.87 12.32,62.87 6.35,56.9 6.35,56.1 U2.12
N$3
  Top 0.254: U1.12 12.57,62.22 6.99,56.64 U2.11
N$4
  Top 0.254: C9.1 20.44,74.56 20.57,74.42 20.57,72.91 U1.62
N$5
  Top 0.254: LED1.A R7.1
N$6
  Top 0.254: U1.24 24.51,57.22 24.51,58.29 25.02,58.8 31.11,58.8 31.75,58.17 Q1.2 C2.1
N$7
  Top 0.406: X1.D- 10.45,69.38 11.18,70.1 R6.2
N$8  (via drill 0.6 pad 0.25)
  Top 0.254: 21.34,57.27 U1.20 | 21.34,57.27 21.34,59.44 v20.32,60.45 | 21.34,57.27 21.34,55.13 R1.1 | RESET.1 89.66,67.18 90.04,66.8 97.03,66.8 97.28,66.55 ICSP.5
  Bottom 0.254: v20.32,60.45 20.32,67.82 20.95,68.45 28.32,68.45 32.77,72.9 90.42,72.9 90.93,72.39 90.93,68.45 90.55,68.07 RESET.1
N$9  (via drill 0.6, 0.6 pad 0.25)
  Top 0.254: IC1.9 v31.37,5.84 31.37,10.92 31.62,11.18 33.66,11.18 33.91,11.43 IC1.18 33.91,14.48 34.16,14.73 40.01,14.73 40.26,14.48 C21.1 | 78.11,14.73 74.8,14.73 74.55,14.48 IC2.18 74.55,11.43 74.3,11.18 72.26,11.18 72.01,10.92 v72.01,5.84 IC2.9 | 78.36,14.48 IC2.15 | 78.11,14.73 78.36,14.48 | 78.11,14.73 78.61,14.73 | 78.36,14.48 78.61,14.73 | 78.61,14.73 80.9,14.73 81.15,14.48 C16.1 | IC4.15 IC4.16 36.45,48.62 36.25,48.82 34.11,48.82 33.91,48.62 IC4.18 33.91,40.39 33.66,40.13 31.62,40.13 31.37,39.88 IC4.9 | IC4.15 37.77,47.24 | IC4.15 37.9,47.38 37.86,47.38 37.72,47.24 40.2,47.24 C18.1 40.26,47.31 v40.26,48.77 | IC3.9 72.01,39.88 72.26,40.13 74.3,40.13 74.55,40.39 IC3.18 74.55,48.64 | 74.68,48.77 74.55,48.64 | 76.96,48.77 74.68,48.77 | 77.22,48.51 76.96,48.77 | 77.22,48.51 77.22,47.33 IC3.16 | 77.47,48.77 77.22,48.51 | 77.47,48.77 76.96,48.77 | C20.1 5.04,50.41 U2.1 5.08,50.38 v5.08,51.56 | 77.47,48.77 80.64,48.77 80.9,48.51 80.9,47.38 C17.1 81.01,47.36 81.15,47.5 v98.68,47.5 | C10.2 57.65,65.54 57.91,65.28 57.91,63.12 57.66,62.87 52.89,62.87 | IC6.5 63.43,63.74 C12.2 v65.28,62.1 | C14.2 78.47,65.54 78.74,65.28 78.74,60.83 | 73.59,62.99 IC7.5 73.59,60.45 | 74.42,48.77 73.79,48.77 v73.59,48.96 v73.59,57.78 73.59,60.45 | 74.55,48.64 74.42,48.77 | 74.68,48.77 74.42,48.77 | 73.59,60.45 73.91,60.45 | 73.91,60.45 78.36,60.45 | 78.36,60.45 78.74,60.45 | 78.74,60.45 79.12,60.45 | 79.12,60.45 ICSP.2 | 73.91,60.45 73.66,60.71 | 73.91,60.45 73.66,60.2 | 78.74,60.45 78.74,60.83 | 78.36,60.45 78.74,60.83 | 78.74,60.83 79.12,60.45 | v51.94,62.23 51.94,62.74 52.07,62.87 52.89,62.87 | 52.89,62.87 IC5.5
  Bottom 0.254: v31.37,5.84 31.37,2.54 31.62,2.29 71.75,2.29 | 71.75,2.29 72.01,2.54 | 72.01,2.54 v72.01,5.84 | 72.01,2.54 72.26,2.29 | 71.75,2.29 72.26,2.29 | v98.68,47.5 98.68,2.54 98.42,2.29 72.26,2.29 | 65.28,57.91 v65.28,62.1 | 65.41,57.78 65.34,57.85 | 65.34,57.85 65.28,57.91 | v73.59,57.78 65.41,57.78 | 65.28,57.78 65.15,57.78 | 65.34,57.85 65.28,57.78 | 65.41,57.78 65.28,57.78 | 65.15,57.78 65.28,57.91 | v5.08,51.56 40.01,51.56 40.26,51.31 v40.26,48.77 73.59,48.77 v73.59,48.96 | 65.15,57.78 52.25,57.78 | 52.25,57.78 51.94,57.78 51.94,58.09 | 51.94,58.09 v51.94,62.23 | 52.25,57.78 51.94,58.09
N$10
  Top 0.254: U1.7 15.54,66.22 arc90 C3.2
N$11
  Top 0.254: R5.1 U1.5
N$12  (via drill 0.6)
  Top 0.254: v36.58,67.82 Q1.1 C1.1 | U1.23 23.75,57.22 23.75,62.23 29.34,67.82 v29.72,67.82
  Bottom 0.254: v29.72,67.82 v36.58,67.82
N$13
  Top 0.254: IC1.21 30.1,10.41 29.84,10.16 11.3,10.16 11.05,10.41 JP3.1
  Bottom 0.406: JP3.1 JP2.1 JP1.1
N$14  (via drill 0.6)
  Top 0.254: U1.43 34.56,67.02 R2.1 34.54,66.84 v34.54,65.79
  Bottom 0.254: v34.54,65.79 38.1,65.79 38.48,66.17 38.48,71.63 38.86,72.01 88.27,72.01 PROGRAM.1
N$15
  Top 0.254: 7.62,56.1 U2.10 7.63,56.53 12.53,61.42 U1.13
N$16
  Top 0.254: R6.1 14.22,70.1 14.48,69.85 14.48,68.83 14.73,68.58 17.05,68.58 U1.4
N$17
  Top 0.254: 9.65,68.58 X1.D+
  Top 0.406: R5.2 11.18,67.82 10.41,68.58 9.65,68.58
N$18
  Top 0.406: X1.VBUS 10.24,70.18 10.67,70.61 10.67,72.14 10.92,72.39 FB1.1
N$19
  Top 0.254: IC1.22 28.83,10.92 28.57,10.67 13.84,10.67 13.59,10.92 JP3.2
  Bottom 0.406: JP3.2 JP2.2 JP1.2
N$20
  Top 0.254: IC1.23 27.56,11.43 27.3,11.18 16.38,11.18 16.13,11.43 JP3.3
  Bottom 0.406: JP3.3 JP2.3 JP1.3
N$21
  Top 0.254: U1.14 15.49,60.62 R7.2
N$22
  Top 0.254: IC1.24 26.29,11.94 26.04,11.68 18.92,11.68 18.67,11.94 JP3.4
  Bottom 0.406: JP3.4 JP2.4 JP1.4
N$23  (via drill 0.6 pad 0.25)
  Top 0.254: v25.02,14.99 IC1.25
  Bottom 0.254: v25.02,14.99 21.46,14.99 21.21,15.24 JP3.5
  Bottom 0.406: JP3.5 JP2.5 JP1.5
N$24
  Top 0.254: IC1.26 JP3.6
  Bottom 0.406: JP3.6 JP2.6 JP1.6
N$25
  Top 0.254: IC1.27 22.48,17.27 22.99,17.78 25.78,17.78 26.29,17.27 JP3.7
  Bottom 0.406: JP3.7 JP2.7 JP1.7
N$26
  Top 0.254: JP2.8 28.83,20.07 28.57,20.32 20.45,20.32 19.94,19.81 19.94,13.46 20.24,13.16 IC1.28
  Bottom 0.406: JP3.8 JP2.8 JP1.8
N$27  (via drill 0.6 pad 0.25)
  Top 0.254: IC1.1 v21.21,5.84
  Bottom 0.254: v21.21,5.84 21.21,11.43 21.46,11.68 31.11,11.68 31.37,11.94 JP6.1
  Bottom 0.406: JP6.1 JP5.1 JP4.1
N$28  (via drill 0.6 pad 0.25)
  Top 0.254: IC1.2 v22.48,6.86
  Bottom 0.254: v22.48,6.86 22.48,10.92 22.73,11.18 33.66,11.18 33.91,11.43 JP6.2
  Bottom 0.406: JP6.2 JP5.2 JP4.2
N$29  (via drill 0.6 pad 0.25)
  Top 0.254: IC1.3 v23.75,5.84
  Bottom 0.254: v23.75,5.84 23.75,10.41 24,10.67 36.2,10.67 36.45,10.92 JP6.3
  Bottom 0.406: JP6.3 JP5.3 JP4.3
N$30  (via drill 0.6 pad 0.25)
  Top 0.254: 25.02,3.05 IC1.4 v25.02,6.86
  Bottom 0.254: v25.02,6.86 25.02,9.91 25.27,10.16 38.73,10.16 38.99,10.41 JP6.4
  Bottom 0.406: JP6.4 JP5.4 JP4.4
N$31  (via drill 0.6 pad 0.25)
  Top 0.254: IC1.5 v26.29,5.84
  Bottom 0.254: v26.29,5.84 26.29,9.4 26.54,9.65 41.27,9.65 41.53,9.91 JP6.5
  Bottom 0.406: JP6.5 JP5.5 JP4.5
N$32  (via drill 0.6 pad 0.25)
  Top 0.254: IC1.6 v27.56,6.86
  Bottom 0.254: v27.56,6.86 27.56,8.89 27.81,9.14 43.81,9.14 44.07,9.4 JP6.6
  Bottom 0.406: JP6.6 JP5.6 JP4.6
N$33  (via drill 0.6 pad 0.25)
  Top 0.254: IC1.7 v28.83,5.84
  Bottom 0.254: v28.83,5.84 28.83,8.38 29.08,8.64 46.35,8.64 46.61,8.89 JP6.7
  Bottom 0.406: JP6.7 JP5.7 JP4.7
N$34  (via drill 0.6 pad 0.25)
  Top 0.254: IC1.8 v30.1,6.86
  Bottom 0.254: v30.1,6.86 30.1,7.87 30.35,8.13 48.9,8.13 49.15,8.38 JP6.8
  Bottom 0.406: JP6.8 JP5.8 JP4.8
N$35
  Top 0.254: IC2.21 70.74,10.41 70.48,10.16 51.94,10.16 51.69,10.41 JP9.1
  Bottom 0.406: JP9.1 JP8.1 JP7.1
N$36
  Top 0.254: IC2.22 69.47,10.92 69.22,10.67 54.48,10.67 54.23,10.92 JP9.2
  Bottom 0.406: JP9.2 JP8.2 JP7.2
N$37
  Top 0.254: IC2.23 68.2,11.43 67.94,11.18 57.02,11.18 56.77,11.43 JP9.3
  Bottom 0.406: JP9.3 JP8.3 JP7.3
N$38
  Top 0.254: IC2.24 66.93,11.94 66.67,11.68 59.56,11.68 59.31,11.94 JP9.4
  Bottom 0.406: JP9.4 JP8.4 JP7.4
N$39  (via drill 0.6 pad 0.25)
  Top 0.254: v65.66,14.99 IC2.25
  Bottom 0.254: v65.66,14.99 62.1,14.99 61.85,15.24 JP9.5
  Bottom 0.406: JP9.5 JP8.5 JP7.5
N$40
  Top 0.254: IC2.26 JP9.6
  Bottom 0.406: JP9.6 JP8.6 JP7.6
N$41
  Top 0.254: IC2.27 63.12,17.53 63.37,17.78 66.42,17.78 66.93,17.27 JP9.7
  Bottom 0.406: JP9.7 JP8.7 JP7.7
N$42
  Top 0.254: IC2.28 60.88,13.16 60.58,13.46 60.58,20.07 60.83,20.32 69.22,20.32 69.47,20.07 JP8.8
  Bottom 0.406: JP9.8 JP8.8 JP7.8
N$43  (via drill 0.6 pad 0.25)
  Top 0.254: IC2.1 v61.85,5.84
  Bottom 0.254: v61.85,5.84 61.85,11.43 62.1,11.68 71.75,11.68 72.01,11.94 JP10.1
  Bottom 0.406: JP10.1 JP12.1 JP11.1
N$44  (via drill 0.6 pad 0.25)
  Top 0.254: IC2.2 v63.12,6.86
  Bottom 0.254: v63.12,6.86 63.12,10.92 63.37,11.18 74.3,11.18 74.55,11.43 JP10.2
  Bottom 0.406: JP10.2 JP12.2 JP11.2
N$45  (via drill 0.6 pad 0.25)
  Top 0.254: IC2.3 v64.39,5.84
  Bottom 0.254: v64.39,5.84 64.39,10.41 64.64,10.67 76.83,10.67 77.09,10.92 JP10.3
  Bottom 0.406: JP10.3 JP12.3 JP11.3
N$46  (via drill 0.6 pad 0.25)
  Top 0.254: IC2.4 v65.66,6.86
  Bottom 0.254: v65.66,6.86 65.66,9.91 65.91,10.16 79.38,10.16 79.63,10.41 JP10.4
  Bottom 0.406: JP10.4 JP12.4 JP11.4
N$47  (via drill 0.6 pad 0.25)
  Top 0.254: IC2.5 v66.93,5.84
  Bottom 0.254: v66.93,5.84 66.93,9.4 67.18,9.65 81.92,9.65 82.17,9.91 JP10.5
  Bottom 0.406: JP10.5 JP12.5 JP11.5
N$48  (via drill 0.6 pad 0.25)
  Top 0.254: IC2.6 v68.2,6.86
  Bottom 0.254: v68.2,6.86 68.2,8.89 68.45,9.14 84.45,9.14 84.71,9.4 JP10.6
  Bottom 0.406: JP10.6 JP12.6 JP11.6
N$49  (via drill 0.6 pad 0.25)
  Top 0.254: IC2.7 v69.47,5.84
  Bottom 0.254: v69.47,5.84 69.47,8.38 69.72,8.64 87,8.64 87.25,8.89 JP10.7
  Bottom 0.406: JP10.7 JP12.7 JP11.7
N$50  (via drill 0.6 pad 0.25)
  Top 0.254: IC2.8 v70.74,6.86
  Bottom 0.254: v70.74,6.86 70.74,7.87 70.99,8.13 89.53,8.13 89.79,8.38 JP10.8
  Bottom 0.406: JP10.8 JP12.8 JP11.8
N$51  (via drill 0.6 pad 0.25)
  Top 0.254: v70.74,43.94 IC3.21
  Bottom 0.254: v70.74,43.94 70.74,42.93 70.99,42.67 89.53,42.67 89.79,42.42 JP15.1
  Bottom 0.406: JP15.1 JP14.1 JP13.1
N$52  (via drill 0.6 pad 0.25)
  Top 0.254: v69.47,44.96 IC3.22
  Bottom 0.254: v69.47,44.96 69.47,42.42 69.72,42.16 87,42.16 87.25,41.91 JP15.2
  Bottom 0.406: JP15.2 JP14.2 JP13.2
N$53  (via drill 0.6 pad 0.25)
  Top 0.254: v68.2,43.94 IC3.23
  Bottom 0.254: v68.2,43.94 68.2,41.91 68.45,41.66 84.45,41.66 84.71,41.4 JP15.3
  Bottom 0.406: JP15.3 JP14.3 JP13.3
N$54  (via drill 0.6 pad 0.25)
  Top 0.254: v66.93,44.96 IC3.24
  Bottom 0.254: v66.93,44.96 66.93,41.4 67.18,41.15 81.92,41.15 82.17,40.89 JP15.4
  Bottom 0.406: JP15.4 JP14.4 JP13.4
N$55  (via drill 0.6 pad 0.25)
  Top 0.254: v65.66,43.94 IC3.25
  Bottom 0.254: v65.66,43.94 65.66,40.89 65.91,40.64 79.38,40.64 79.63,40.39 JP15.5
  Bottom 0.406: JP15.5 JP14.5 JP13.5
N$56  (via drill 0.6 pad 0.25)
  Top 0.254: v64.39,44.96 IC3.26
  Bottom 0.254: v64.39,44.96 64.39,40.39 64.64,40.13 76.83,40.13 77.09,39.88 JP15.6
  Bottom 0.406: JP15.6 JP14.6 JP13.6
N$57  (via drill 0.6 pad 0.25)
  Top 0.254: v63.12,43.94 IC3.27
  Bottom 0.254: v63.12,43.94 63.12,39.88 63.37,39.62 74.3,39.62 74.55,39.37 JP15.7
  Bottom 0.406: JP15.7 JP14.7 JP13.7
N$58  (via drill 0.6 pad 0.25)
  Top 0.254: v61.85,44.96 IC3.28
  Bottom 0.254: v61.85,44.96 61.85,39.37 62.1,39.12 71.75,39.12 72.01,38.86 JP15.8
  Bottom 0.406: JP13.8 JP14.8 JP15.8
N$59
  Top 0.254: IC3.1 60.88,37.64 60.58,37.34 60.58,30.99 61.09,30.48 69.22,30.48 69.47,30.73 JP18.1
  Bottom 0.406: JP16.1 JP18.1 JP17.1
N$60
  Top 0.254: IC3.2 63.12,33.53 63.63,33.02 66.42,33.02 66.93,33.53 JP17.2
  Bottom 0.406: JP16.2 JP18.2 JP17.2
N$61
  Top 0.254: JP17.3 IC3.3
  Bottom 0.406: JP16.3 JP18.3 JP17.3
N$62  (via drill 0.6 pad 0.25)
  Top 0.254: v65.66,35.81 IC3.4
  Bottom 0.254: v65.66,35.81 62.1,35.81 61.85,35.56 JP17.4
  Bottom 0.406: JP16.4 JP18.4 JP17.4
N$63
  Top 0.254: IC3.5 66.93,38.86 66.67,39.12 59.56,39.12 59.31,38.86 JP17.5
  Bottom 0.406: JP16.5 JP18.5 JP17.5
N$64
  Top 0.254: IC3.6 68.2,39.37 67.94,39.62 57.02,39.62 56.77,39.37 JP17.6
  Bottom 0.406: JP16.6 JP18.6 JP17.6
N$65
  Top 0.254: IC3.7 69.47,39.88 69.22,40.13 54.48,40.13 54.23,39.88 JP17.7
  Bottom 0.406: JP16.7 JP18.7 JP17.7
N$66
  Top 0.254: IC3.8 70.74,40.39 70.48,40.64 51.94,40.64 51.69,40.39 JP17.8
  Bottom 0.406: JP16.8 JP18.8 JP17.8
N$67  (via drill 0.6 pad 0.25)
  Top 0.254: v30.1,43.94 IC4.21
  Bottom 0.254: v30.1,43.94 30.1,42.93 30.35,42.67 48.9,42.67 49.15,42.42 JP20.1
  Bottom 0.406: JP19.1 JP21.1 JP20.1
N$68  (via drill 0.6 pad 0.25)
  Top 0.254: v28.83,44.96 IC4.22
  Bottom 0.254: v28.83,44.96 28.83,42.42 29.08,42.16 46.35,42.16 46.61,41.91 46.61,33.78
  Bottom 0.406: JP19.2 JP21.2 46.61,33.78 JP20.2
N$69  (via drill 0.6 pad 0.25)
  Top 0.254: v27.56,43.94 IC4.23
  Bottom 0.254: v27.56,43.94 27.56,41.91 27.81,41.66 43.81,41.66 44.07,41.4 JP20.3
  Bottom 0.406: JP19.3 JP21.3 JP20.3
N$70  (via drill 0.6 pad 0.25)
  Top 0.254: v26.29,44.96 IC4.24
  Bottom 0.254: v26.29,44.96 26.29,41.4 26.54,41.15 41.27,41.15 41.53,40.89 JP20.4
  Bottom 0.406: JP19.4 JP21.4 JP20.4
N$71  (via drill 0.6 pad 0.25)
  Top 0.254: v25.02,43.94 IC4.25
  Bottom 0.254: v25.02,43.94 25.02,40.89 25.27,40.64 38.73,40.64 38.99,40.39 JP20.5
  Bottom 0.406: JP19.5 JP21.5 JP20.5
N$72  (via drill 0.6 pad 0.25)
  Top 0.254: v23.75,44.96 IC4.26
  Bottom 0.254: v23.75,44.96 23.75,40.39 24,40.13 36.2,40.13 36.45,39.88 JP20.6
  Bottom 0.406: JP19.6 JP21.6 JP20.6
N$73  (via drill 0.6 pad 0.25)
  Top 0.254: v22.48,43.94 IC4.27
  Bottom 0.254: v22.48,43.94 22.48,39.88 22.73,39.62 33.66,39.62 33.91,39.37 JP20.7
  Bottom 0.406: JP19.7 JP21.7 JP20.7
N$74  (via drill 0.6 pad 0.25)
  Top 0.254: v21.21,44.96 IC4.28
  Bottom 0.254: v21.21,44.96 21.21,39.37 21.46,39.12 31.11,39.12 31.37,38.86 JP20.8
  Bottom 0.406: JP19.8 JP21.8 JP20.8
N$75
  Top 0.254: IC4.1 20.24,37.64 19.94,37.34 19.94,30.99 20.45,30.48 28.32,30.48 28.83,30.99 JP23.1
  Bottom 0.406: JP24.1 JP23.1 JP22.1
N$76
  Top 0.254: IC4.2 22.48,33.53 22.99,33.02 25.78,33.02 26.29,33.53 JP22.2
  Bottom 0.406: JP24.2 JP23.2 JP22.2
N$77
  Top 0.254: JP22.3 IC4.3
  Bottom 0.406: JP24.3 JP23.3 JP22.3
N$78  (via drill 0.6 pad 0.25)
  Top 0.254: v25.02,35.81 IC4.4
  Bottom 0.254: v25.02,35.81 21.46,35.81 21.21,35.56 JP22.4
  Bottom 0.406: JP24.4 JP23.4 JP22.4
N$79
  Top 0.254: IC4.5 26.29,38.86 26.04,39.12 18.92,39.12 18.67,38.86 JP22.5
  Bottom 0.406: JP24.5 JP23.5 JP22.5
N$80
  Top 0.254: 16.13,33.78 JP22.6 16.13,39.37 16.38,39.62 27.3,39.62 27.56,39.37 IC4.6
  Bottom 0.406: JP24.6 JP23.6 JP22.6
N$81
  Top 0.254: IC4.7 28.83,39.88 28.57,40.13 13.84,40.13 13.59,39.88 JP22.7
  Bottom 0.406: JP24.7 JP23.7 JP22.7
N$82
  Top 0.254: IC4.8 30.1,40.39 29.84,40.64 11.3,40.64 11.05,40.39 JP22.8
  Bottom 0.406: JP24.8 JP23.8 JP22.8
N$84  (via drill 0.6, 0.6 pad 0.25)
  Top 0.254: IC1.12 35.18,9.4 35.43,9.65 45.09,9.65 45.34,9.91 45.34,24.38 | IC2.12 75.82,8.89 76.07,9.14 85.72,9.14 85.98,9.4 85.98,24.51 | IC4.12 v35.18,24.77 44.96,24.77 | v30.1,24.77 6.99,24.77 6.33,25.41 U2.3 | 44.96,24.77 45.34,24.38 | v75.82,27.94 IC3.12 | v51.69,24.77 v75.82,24.77 85.34,24.77 85.72,24.77 | 45.34,24.38 45.72,24.77 v45.34,24.77 | 45.21,24.77 v45.34,24.77 | v45.34,24.77 45.47,24.77 45.34,24.64 45.21,24.77 | 44.96,24.77 45.21,24.77 | 85.72,24.77 85.98,24.51 | 85.98,24.51 v85.98,24.77 85.72,24.77
  Bottom 0.254: v30.1,24.77 v35.18,24.77 | v75.82,24.77 v75.82,27.94 | v45.34,24.77 v51.69,24.77 | ICSP.7 98.55,68.07 98.68,67.94 98.68,57.15 97.03,55.5 97.03,25.02 96.77,24.77 v85.98,24.77
N$85  (via drill 0.6, 0.6 pad 0.25)
  Top 0.254: IC4.13 36.45,36.58 37.72,35.31 v37.72,26.04 v47.88,26.04 47.88,9.4 47.62,9.14 36.7,9.14 36.45,8.89 IC1.13 | IC3.13 77.09,36.58 78.36,35.31 v78.36,27.94 | IC2.13 77.09,8.38 77.34,8.64 88.27,8.64 88.52,8.89 88.52,25.78 | v27.56,26.04 7.62,26.04 6.99,26.67 U2.4 | 88.27,26.04 88.52,25.78 | v54.23,26.04 v78.36,26.04 88.27,26.04 | 88.52,25.78 88.52,26.04 v88.39,26.04 88.27,26.04
  Bottom 0.254: v27.56,26.04 v37.72,26.04 | v78.36,26.04 v78.36,27.94 | v47.88,26.04 v54.23,26.04 | ICSP.1 97.28,57.53 95.25,55.5 95.25,26.42 94.87,26.04 v88.39,26.04
N$86  (via drill 0.6, 0.6 pad 0.25)
  Top 0.254: IC4.14 39.96,37.64 40.26,37.34 v40.26,27.3 50.04,27.3 50.42,26.92 | IC3.14 80.6,37.64 80.9,37.34 80.9,27.05 | IC1.14 37.72,8.38 37.97,8.64 50.16,8.64 50.42,8.89 50.42,26.92 | IC2.14 78.36,7.87 78.61,8.13 90.81,8.13 91.06,8.38 91.06,26.67 | v25.02,27.3 8.26,27.3 7.63,27.93 U2.5 | 80.77,26.92 80.9,27.05 | 50.42,26.92 80.77,26.92 | 80.9,27.05 81.03,26.92 | 80.77,26.92 81.03,26.92 | 81.03,26.92 90.3,26.92 90.81,26.92 | 90.81,26.92 91.06,26.67 | 91.06,26.67 v91.06,26.92 90.81,26.92
  Bottom 0.254: v25.02,27.3 v40.26,27.3 | ICSP.9 96.14,70.61 96.01,70.48 96.01,59.56 91.95,55.5 91.95,27.18 91.69,26.92 v91.06,26.92
N$87
  Top 0.254: C15.1 71.69,63.74 IC7.4
N$91  (via drill 0.6)
  Top 0.254: IC3.11 74.55,36.58 73.28,35.31 v73.28,27.94 | IC1.11 33.91,9.91 34.16,10.16 42.55,10.16 42.8,10.41 42.8,23.11 | IC2.11 74.55,9.4 74.8,9.65 83.19,9.65 83.44,9.91 83.44,23.24 | IC4.11 33.91,36.58 32.64,35.31 32.64,23.88 | 32.26,23.5 32.64,23.88 | 32.26,23.5 6.35,23.5 5.68,24.16 U2.2 | 32.26,23.5 32.77,23.5 | 32.77,23.5 33.02,23.5 | 32.64,23.88 33.02,23.5 | 32.64,23.88 32.64,23.62 32.77,23.5 | 33.02,23.5 42.42,23.5 | 42.42,23.5 42.8,23.11 | 42.42,23.5 v42.8,23.5 | 42.8,23.11 43.18,23.5 v42.8,23.5 | 42.8,23.11 v42.8,23.5 | v73.28,23.5 83.19,23.5 | 83.19,23.5 83.44,23.24 | ICSP.3 96.27,62.99 96.01,62.74 96.01,57.91 v93.6,55.5 | 83.44,23.24 v83.44,23.5 | 83.19,23.5 v83.44,23.5 | v83.44,23.5 83.06,23.5 | v93.6,23.5 v93.6,26.92
  Bottom 0.254: v42.8,23.5 72.77,23.5 | 73.28,24 v73.28,27.94 | 72.77,23.5 73.28,24 | 72.77,23.5 v73.28,23.5 | v73.28,23.5 73.28,23.75 | 73.28,24 73.28,23.75 | 73.28,23.75 73.15,23.62 v73.28,23.5 | v93.6,26.92 v93.6,55.5 | v83.44,23.5 92.84,23.5 v93.6,23.5
N$127
  Top 0.254: R3.2 50.94,66 IC5.3 50.99,64.84 50.8,64.64 32.69,64.64 U1.40
N$128
  Top 0.254: 60.93,65.94 IC6.3 | 60.71,66.17 60.93,65.94 | 60.71,66.17 R4.2 | U1.39 46.16,63.82 48.9,61.09 60.33,61.09 60.71,61.47 60.71,65.66 | 60.93,65.94 60.93,65.88 60.71,65.66 | 60.71,65.66 60.71,66.17
N$129
  Top 0.254: R17.2 71.69,67.64 IC7.3 71.6,65.94 70.99,66.55 69.09,66.55 68.96,66.42 68.96,60.71 68.58,60.33 48.26,60.33 45.56,63.02 U1.38
N$130
  Top 0.254: C7.1 50.99,63.74 IC5.4
VCC  (via drill 0.6)
  Top 0.254: 5.08,63.25 5.08,73.91 5.84,74.68 13.21,74.68 | 13.72,74.17 13.72,72.51 FB1.2 | U1.8 16.98,65.53 17.45,65.53 17.55,65.43 18.26,65.43 | U1.64 18.89,69.69 v18.54,69.34 17.17,69.34 U1.3 17.05,69.47 15.75,69.47 13.72,71.5 13.72,74.68 | U1.8 16.95,65.28 | 5.59,62.74 10.41,62.74 11.68,64.01 11.68,65.34 C4.1 | 5.59,62.74 5.08,63.25 | 5.08,62.36 5.08,63.25 | 5.08,62.23 5.08,62.36 | 5.08,62.23 5.59,62.74 | 5.59,62.74 5.33,62.74 5.21,62.87 5.21,62.48 5.08,62.36 | 5.08,62.23 5.08,56.13 U2.14 | C6.1 4.96,56.02 U2.14 | U2.8 8.94,55.16 8.76,54.99 5.33,54.99 5.08,55.24 5.08,56.04 U2.14 | 13.21,74.68 13.72,74.17 | 13.21,74.68 13.72,74.68 | 13.72,74.68 14.1,74.68 | 14.17,74.68 14.17,74.62 13.72,74.17 | 13.72,74.17 13.72,74.42 13.89,74.6 13.59,74.6 13.51,74.52 13.95,74.52 14.1,74.68 | 14.17,74.68 14.86,74.68 | 14.86,74.68 14.95,74.68 C5.1 14.97,74.56 14.86,74.68 | 14.1,74.68 14.17,74.68 | U1.52 28.45,72.78 28.45,72.77 28.57,72.64 v28.57,70.48 30.35,70.48 32.77,72.9 34.42,72.9 | U1.8 v18.54,65.42 21.7,65.42 22.1,65.02 U1.21 22.09,53.59 21.84,53.34 20.97,53.34 R1.2 | R2.2 34.67,68.77 34.67,72.9 | 34.54,72.9 34.67,72.9 | 34.67,72.9 34.8,72.9 | 34.8,72.9 34.67,72.77 34.54,72.9 | 34.42,72.9 34.54,72.9 | 34.42,72.9 34.67,72.64 34.92,72.9 | 34.92,72.9 34.8,72.9 | 52.45,72.9 52.89,72.46 | 34.92,72.9 52.45,72.9 | C8.1 53.29,65.54 arc-90 IC5.1 arc-90 52.83,66 v52.83,68.07 | IC6.1 63.43,64.84 63.63,64.64 67.18,64.64 67.31,64.52 C11.1 67.32,63.75 68.2,63.75 68.33,63.88 68.33,67.31 68.71,67.69 R17.1 69.84,72.78 | 52.89,72.46 52.9,72.46 53.09,72.64 | 52.7,72.9 53.34,72.9 | 52.45,72.9 52.7,72.9 | 52.7,72.9 52.96,72.64 53.09,72.64
  Top 0.254: 53.34,72.9 53.09,72.64 | C13.1 73.59,65.54 IC7.1 73.59,72.2 72.9,72.9 69.95,72.9 | 53.34,72.9 69.72,72.9 | 69.72,72.9 69.84,72.78 | 69.84,72.78 69.95,72.9 | 69.72,72.9 69.95,72.9 | 52.89,72.46 52.89,70.93 arc-90 v52.83,70.87
  Bottom 0.254: v28.57,70.48 19.68,70.48 v18.54,69.34 v18.54,65.42 | v52.83,70.87 v52.83,68.07

### Text on the board
tNames: PROGRAM | RESET | ICSP | R7 | C6 | LED1 | Gumbi v1.1 | R1 | http://www.tacnetsol.com | C20 | IC4 | IC3 | 64 | 49 | 33 | 1 | 16 | 32 | IC1 | IC2